# Altium schematic sheet IOT_Masterv2_301115.SchDoc
size A2
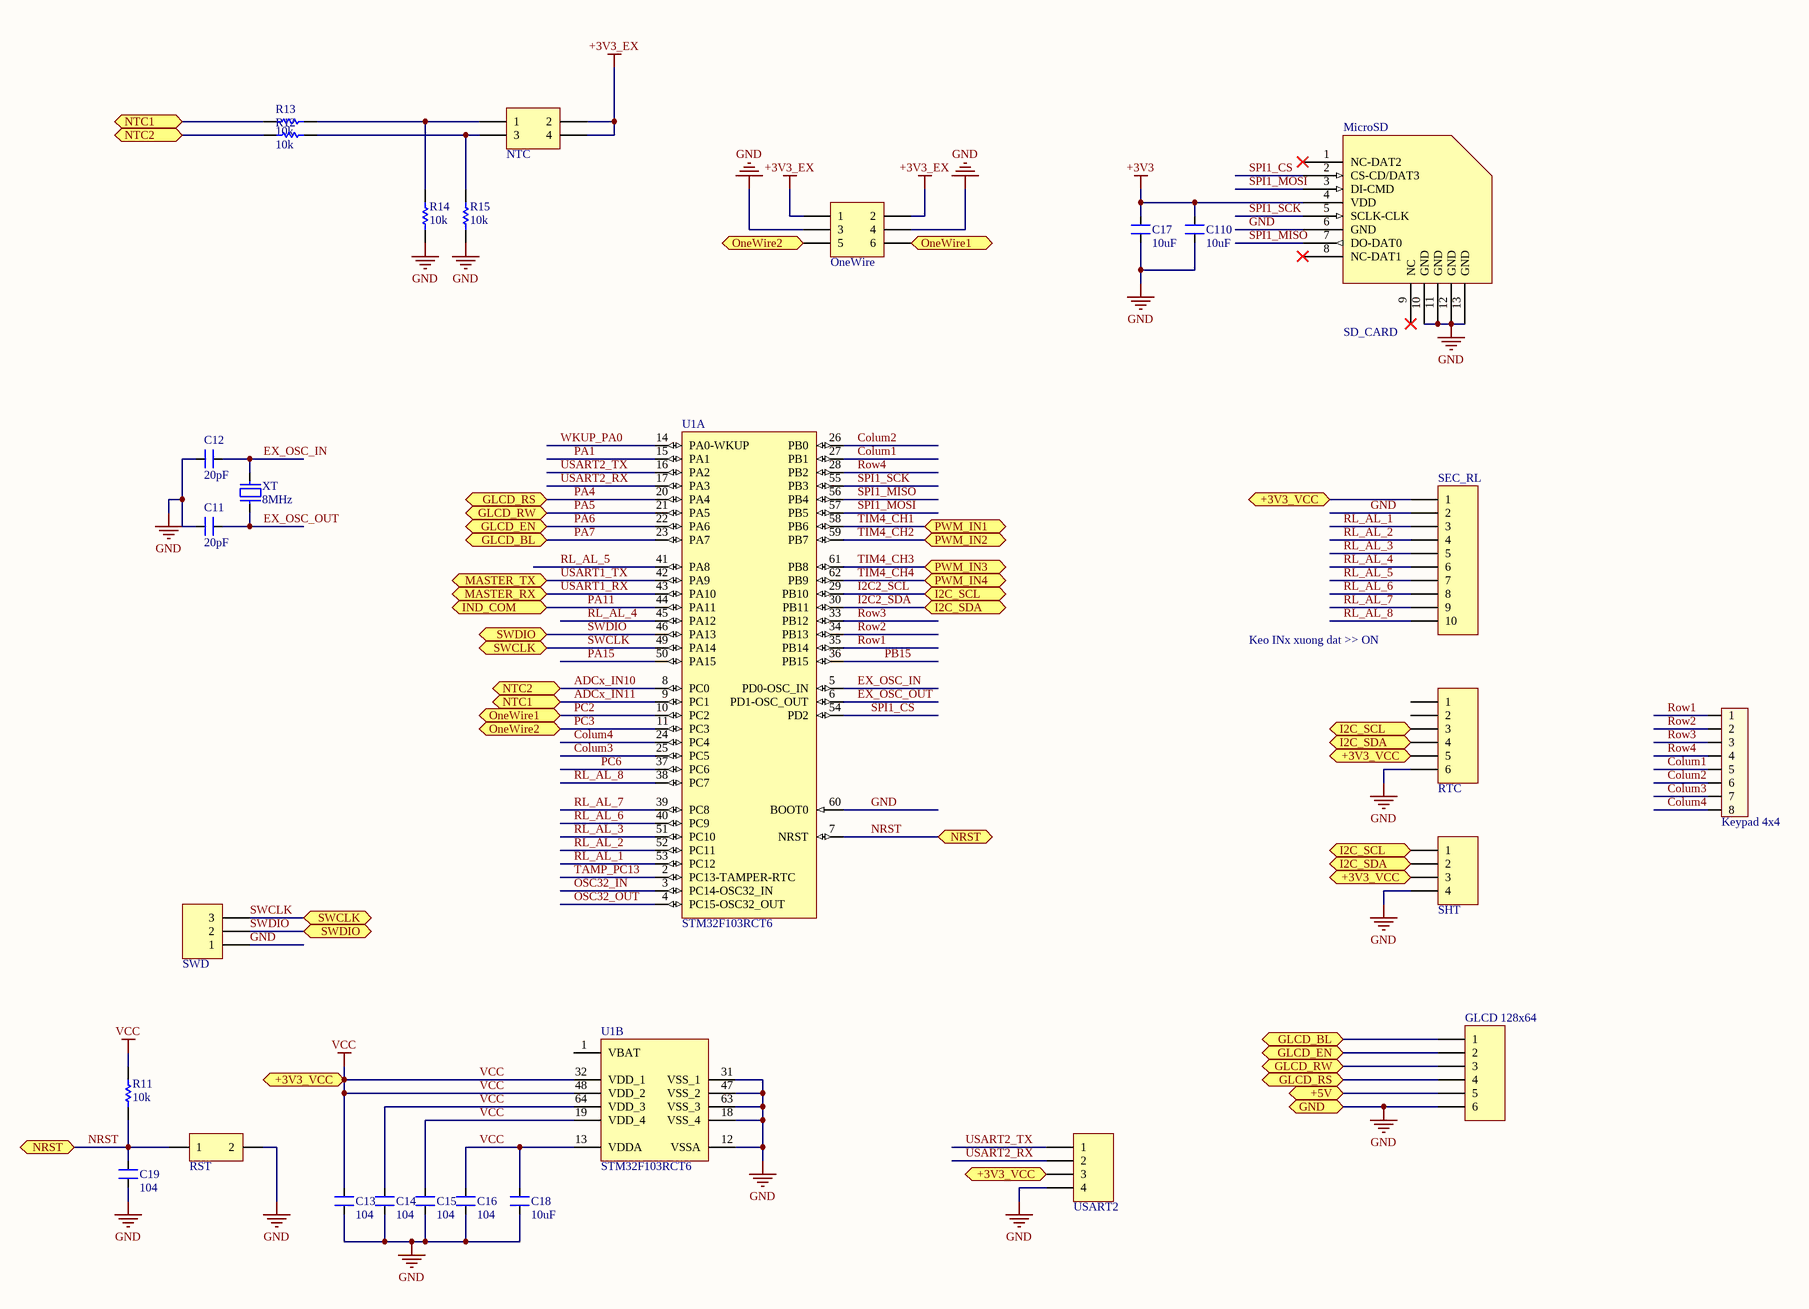
[diagram p0: IOT_Masterv2_301115.SchDoc]

## Parts
C11  value 20pF  [CAPC1608N]  (hidden comment: Cap_22p_0603)
C12  value 20pF  [CAPC1608N]  (hidden comment: Cap_22p_0603)
C13  value 104  [CAPC1608N]  (hidden comment: Cap_104_0603)
C14  value 104  [CAPC1608N]  (hidden comment: Cap_104_0603)
C15  value 104  [CAPC1608N]  (hidden comment: Cap_104_0603)
C16  value 104  [CAPC1608N]  (hidden comment: Cap_104_0603)
C17  value 10uF  [CAPC2012N_F]  (hidden comment: CAP NP)
C18  value 10uF  [CAPC2012N_F]  (hidden comment: Cap_10uF_0805)
C19  value 104  [CAPC1608N]  (hidden comment: Cap_104_0603)
C110  value 10uF  [CAPC2012N_F]  (hidden comment: CAP NP)
GLCD_128x64  Header 6  [HDR1X6]  (value not drawn)
Keypad_4x4  JP8  [CON8]  (value not drawn)
MicroSD  SD_CARD  [MICROSD2]
NTC  Header 2X2  [HDR2X2]  (value not drawn)
OneWire  Header 3X2  [HDR2X3]  (value not drawn)
R11  value 10k  [RESC1608N_F]  (hidden comment: Res_10k_0603)
R12  value 10k  [RESC1608N_ZERO]  (hidden comment: Res)
R13  value 10k  [RESC1608N_ZERO]  (hidden comment: Res)
R14  value 10k  [RESC1608N_ZERO]  (hidden comment: Res)
R15  value 10k  [RESC1608N_ZERO]  (hidden comment: Res)
RST  Button  [SW]  (value not drawn)
RTC  Header 6  [HDR1X6]  (value not drawn)
SEC_RL  Header 10  [HDR1X10]  (value not drawn)
SHT  Header 4  [HDR1X4]  (value not drawn)
SWD  Header 3  [HDR1X3]  (value not drawn)
U1  STM32F103RCT6  [LQFP64_Tuan]  (parts A,B of 2)
USART2  Header 4  [HDR1X4]  (value not drawn)
XT  8MHz  [XT2]

## Ports
+3V3_VCC, +5V, GLCD_BL, GLCD_EN, GLCD_RS, GLCD_RW, GND, I2C_SCL, I2C_SDA, IND_COM, MASTER_RX, MASTER_TX, NRST, NTC1, NTC2, OneWire1, OneWire2, PWM_IN1, PWM_IN2, PWM_IN3, PWM_IN4, SWCLK, SWDIO

## Nets
+3V3: C17.2 C110.2 MicroSD.4(VDD)
+3V3_EX: NTC.2 NTC.4 OneWire.1 OneWire.2
GND: C11.2 C12.2 C13.1 C14.1 C15.1 C16.1 C17.1 C18.1 C19.1 C110.1 GLCD_128x64.6 MicroSD.6(GND) MicroSD.10(GND) MicroSD.11(GND) MicroSD.12(GND) MicroSD.13(GND) OneWire.3 OneWire.4 R14.1 R15.1 RST.2 RTC.6 SEC_RL.2 SHT.4 SWD.1 U1.12(VSSA) U1.18(VSS_4) U1.31(VSS_1) U1.47(VSS_2) U1.60(BOOT0) U1.63(VSS_3) USART2.4 ; port GND
VCC: C13.2 C14.2 C15.2 C16.2 C18.2 R11.2 RTC.5 SEC_RL.1 SHT.3 U1.13(VDDA) U1.19(VDD_4) U1.32(VDD_1) U1.48(VDD_2) U1.64(VDD_3) USART2.3 ; port +3V3_VCC
+5V: GLCD_128x64.5 ; port +5V
ADCx_IN10: R12.2 U1.8(PC0) ; port NTC2
ADCx_IN11: R13.2 U1.9(PC1) ; port NTC1
Colum1: Keypad_4x4.5 U1.27(PB1)
Colum2: Keypad_4x4.6 U1.26(PB0)
Colum3: Keypad_4x4.7 U1.25(PC5)
Colum4: Keypad_4x4.8 U1.24(PC4)
EX_OSC_IN: C12.1 U1.5(PD0-OSC_IN) XT.2
EX_OSC_OUT: C11.1 U1.6(PD1-OSC_OUT) XT.1
I2C2_SCL: RTC.3 SHT.1 U1.29(PB10) ; port I2C_SCL
I2C2_SDA: RTC.4 SHT.2 U1.30(PB11) ; port I2C_SDA
NRST: C19.2 R11.1 RST.1 U1.7(NRST) ; port NRST
OSC32_IN: U1.3(PC14-OSC32_IN)
OSC32_OUT: U1.4(PC15-OSC32_OUT)
PA1: U1.15(PA1)
PA4: GLCD_128x64.4 U1.20(PA4) ; port GLCD_RS
PA5: GLCD_128x64.3 U1.21(PA5) ; port GLCD_RW
PA6: GLCD_128x64.2 U1.22(PA6) ; port GLCD_EN
PA7: GLCD_128x64.1 U1.23(PA7) ; port GLCD_BL
PA11: U1.44(PA11) ; port IND_COM
PA15: U1.50(PA15)
PB15: U1.36(PB15)
PC2: OneWire.6 U1.10(PC2) ; port OneWire1
PC3: OneWire.5 U1.11(PC3) ; port OneWire2
PC6: U1.37(PC6)
RL_AL_1: SEC_RL.3 U1.53(PC12)
RL_AL_2: SEC_RL.4 U1.52(PC11)
RL_AL_3: SEC_RL.5 U1.51(PC10)
RL_AL_4: SEC_RL.6 U1.45(PA12)
RL_AL_5: SEC_RL.7 U1.41(PA8)
RL_AL_6: SEC_RL.8 U1.40(PC9)
RL_AL_7: SEC_RL.9 U1.39(PC8)
RL_AL_8: SEC_RL.10 U1.38(PC7)
Row1: Keypad_4x4.1 U1.35(PB14)
Row2: Keypad_4x4.2 U1.34(PB13)
Row3: Keypad_4x4.3 U1.33(PB12)
Row4: Keypad_4x4.4 U1.28(PB2)
SPI1_CS: MicroSD.2(CS-CD/DAT3) U1.54(PD2)
SPI1_MISO: MicroSD.7(DO-DAT0) U1.56(PB4)
SPI1_MOSI: MicroSD.3(DI-CMD) U1.57(PB5)
SPI1_SCK: MicroSD.5(SCLK-CLK) U1.55(PB3)
SWCLK: SWD.3 U1.49(PA14) ; port SWCLK
SWDIO: SWD.2 U1.46(PA13) ; port SWDIO
TAMP_PC13: U1.2(PC13-TAMPER-RTC)
TIM4_CH1: U1.58(PB6) ; port PWM_IN1
TIM4_CH2: U1.59(PB7) ; port PWM_IN2
TIM4_CH3: U1.61(PB8) ; port PWM_IN3
TIM4_CH4: U1.62(PB9) ; port PWM_IN4
USART1_RX: U1.43(PA10) ; port MASTER_RX
USART1_TX: U1.42(PA9) ; port MASTER_TX
USART2_RX: U1.17(PA3) USART2.2
USART2_TX: U1.16(PA2) USART2.1
WKUP_PA0: U1.14(PA0-WKUP)
NetNTC_1: NTC.1 R13.1 R14.2
NetNTC_3: NTC.3 R12.1 R15.2

Not connected (* = marked no-connect by the designer): MicroSD 1(NC-DAT2)* 8(NC-DAT1)* 9(NC)*; RTC 1 2; U1 1(VBAT)

## Notes on the sheet
- Keo INx xuong dat >> ON

## Library data of the parts
C11-C16 C18 C19 = CAP NP
GLCD_128x64 RTC = Header 6: Header, 6-Pin; LatestRevisionDate: 17-Jul-2002; LatestRevisionNote: Re-released for DXP Platform.; Publisher: Altium Limited
Keypad_4x4 = Con8: Connector 8; Value: Connector 8
MicroSD = MicroSD: SD/MMC holder; Name: SD/MMC; Price: 10000
NTC = Header 2X2: Header, 2-Pin, Dual row; LatestRevisionDate: 17-Jul-2002; LatestRevisionNote: Re-released for DXP Platform.; Publisher: Altium Limited
OneWire = Header 3X2: Header, 3-Pin, Dual row; LatestRevisionDate: 17-Jul-2002; LatestRevisionNote: Re-released for DXP Platform.; Publisher: Altium Limited
R11 = Res
RST = Button I
SEC_RL = Header 10: Header, 10-Pin; LatestRevisionDate: 17-Jul-2002; LatestRevisionNote: Re-released for DXP Platform.; Publisher: Altium Limited
SHT USART2 = Header 4: Header, 4-Pin; LatestRevisionDate: 17-Jul-2002; LatestRevisionNote: Re-released for DXP Platform.; Publisher: Altium Limited
SWD = Header 3: Header, 3-Pin; LatestRevisionDate: 17-Jul-2002; LatestRevisionNote: Re-released for DXP Platform.; Publisher: Altium Limited
U1 = STM32F103RCT6: ARM Cortex-M3 32-bit MCU, 256 KB Flash, 48 KB Internal RAM, 51 I/Os, 64-pin LQFP, -40 to 85 degC, Tray; A/D Converter: 3x12-bit (16 Channel); D/A Converter: 2x12-bit (2 Channel); FLASH Size (Prog) (kB): 256; I/Os (High Current): 51; Internal RAM Size (kB): 48; Operating Frequency(F) (Processor speed) (MHz): 72; Supply Voltage(Vcc) min (V): 2; DatasheetVersion: Rev. 8; PackageVersion: Rev. 4, 06/2013; PackageReference: LQFP64; PackageDescription: 64-Pin Low Profile Quad Flat Package, 10 x 10 mm Body, 0.5 mm Pitch; Supplier 1: Digi-Key; Supplier Part Number 1: 497-9033-ND; Supplier 2: Newark; Supplier Part Number 2: 01P4099; Supplier 3: Newark; Supplier Part Number 3: 57P1227; Supplier 4: Mouser; Supplier Part Number 4: 511-STM32F103RCT6; Core: ARM Cortex-M3; Packing: Tray; Mounting Technology: Surface Mount; PartNumber: STM32F103RCT6; ComponentLink1Description: Manufacturer URL; ComponentLink1URL: http://www.st.com/web/en/home.html; ComponentLink2Description: Datasheet; ComponentLink2URL: http://www.st.com/st-web-ui/static/active/en/resource/technical/document/datasheet/CD00191185.pdf; ComponentLink3Description: Package Specification; ComponentLink3URL: http://www.st.com/st-web-ui/static/active/en/resource/technical/document/datasheet/DM00037051.pdf
XT = Crystal